# Altium schematic sheet BQ25XXX-EVALUATION.SchDoc
size A3; DocumentNumber: 5; SheetNumber: 5; SheetTotal: 14
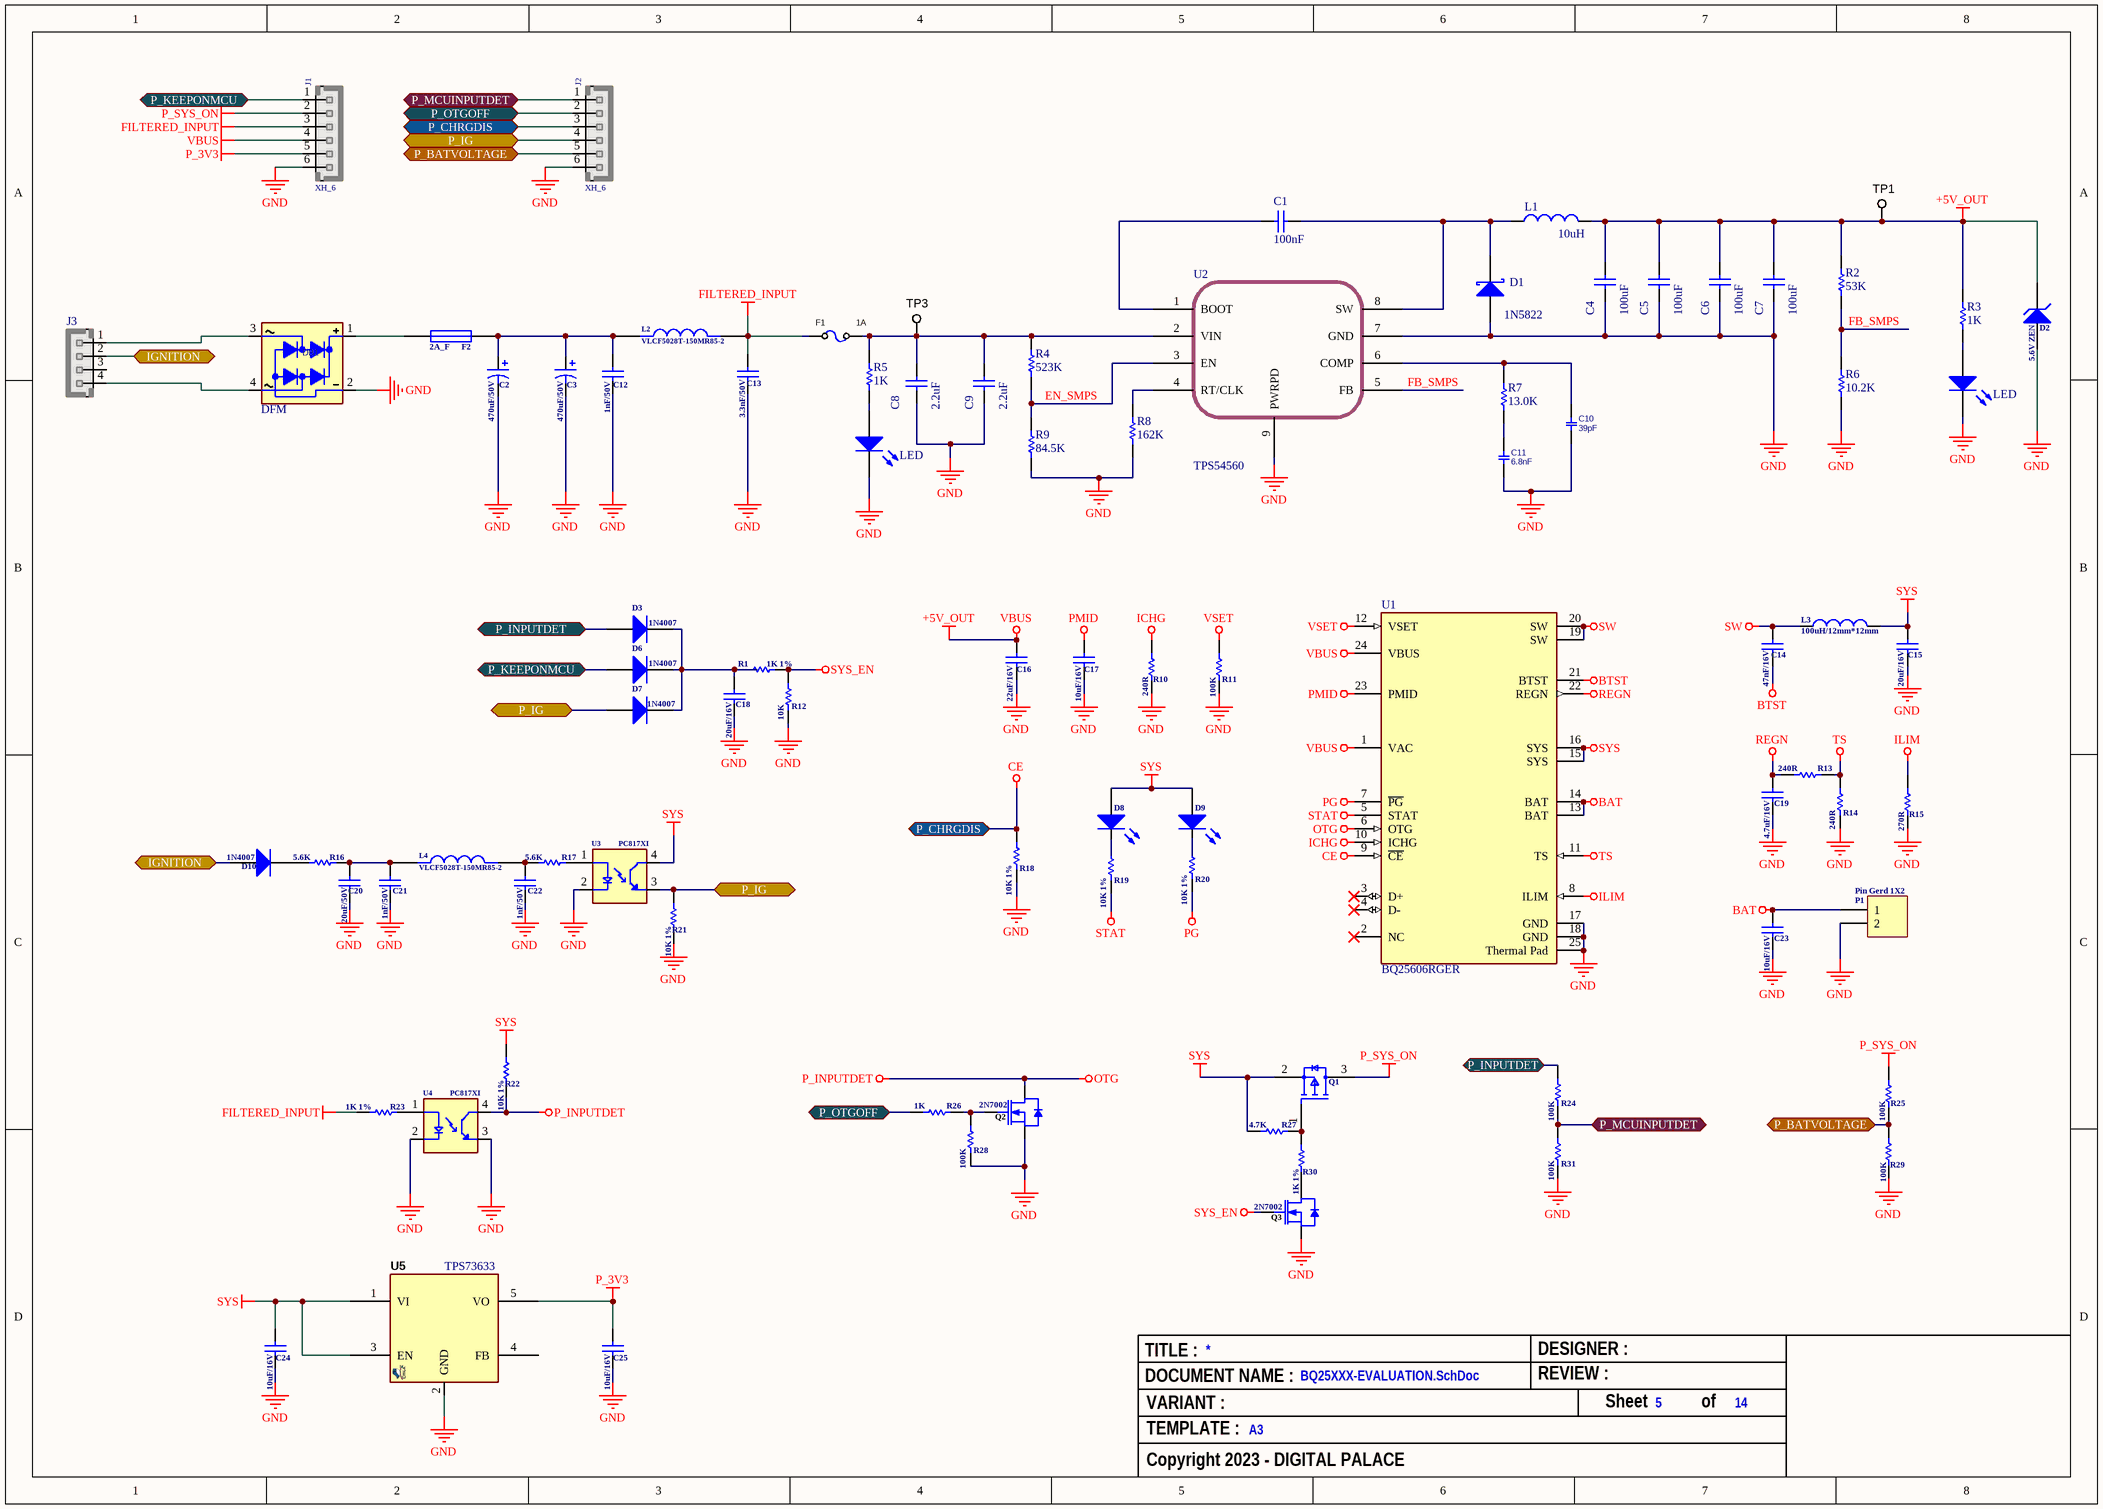
[diagram p0: BQ25XXX-EVALUATION.SchDoc]

## Parts
C1  100nF  [C0603E]
C2  value 470uF/50V  [CAPR5-10x10]
C3  value 470uF/50V  [CAPR5-10x10]
C4  100uF  [C1210]
C5  100uF  [C1210]
C6  100uF  [C1210]
C7  100uF  [C1210]
C8  2.2uF  [C1210]
C9  2.2uF  [C1210]
C10  39pF  [C0603E]
C11  6.8nF  [C0603E]
C12  value 1nF/50V  [C0805]
C13  value 3.3nF/50V  [C0805]
C14  value 47nF/16V  [C0805]
C15  value 20uF/16V  [C0805]
C16  value 22uF/16V  [C0805]
C17  value 10uF/16V  [C0805]
C18  value 20uF/16V  [C0805]
C19  value 4.7uF/16V  [C0805]
C20  value 20uF/50V  [C0805]
C21  value 1nF/50V  [C0805]
C22  value 1nF/50V  [C0805]
C23  value 10uF/16V  [C0805]
C24  value 10uF/16V  [C0805]
C25  value 10uF/16V  [C0805]
D1  1N5822  [D_SMC]
D2  value 5.6V ZEN  [Zener DO213]  (hidden comment: D Zener)
D3  value 1N4007  [Diode_SMC_2]  (hidden comment: SS34/5822)
D4  LED  [LED0603BLU]
D5  LED  [LED0603BLU]
D6  value 1N4007  [Diode_SMC_2]  (hidden comment: SS34/5822)
D7  value 1N4007  [Diode_SMC_2]  (hidden comment: SS34/5822)
D8  (no value)  [LED-0]
D9  (no value)  [LED-0]
D10  value 1N4007  [Diode_SMC_2]  (hidden comment: SS34/5822)
DB1  DFM  [DBRG_DIPSMD]
F1  1A  [F1206]
F2  value 2A_F  [FUSE_1206]  (hidden comment: 1A_FAST)
J1  XH_6  [XH_6]
J2  XH_6  [XH_6]
J3  HHDR_4  [XH_4]  (value not drawn)
L1  10uH  [L_10]
L2  VLCF5028T-150MR85-2  [IND_VLCF5028T-221MR22-2]
L3  value 100uH/12mm*12mm  [L_12X12]  (hidden comment: Inductor)
L4  VLCF5028T-150MR85-2  [IND_VLCF5028T-221MR22-2]
P1  value Pin Gerd 1X2  [HDR1X2]  (hidden comment: Header 2)
Q1  SI2305-TP  [FP-SOT-23-IPC_B]  (value not drawn)
Q2  value 2N7002  [SOT23]
Q3  value 2N7002  [SOT23]
R1  value 1K 1%  [J1-0603]
R2  53K  [R0603E]
R3  1K  [R0603E]
R4  523K  [R0603E]
R5  1K  [R0603E]
R6  10.2K  [R0603E]
R7  13.0K  [R0603E]
R8  162K  [R0603E]
R9  84.5K  [R0603E]
R10  value 240R  [6-0805_N]
R11  value 100K  [6-0805_N]
R12  value 10K  [J1-0603]
R13  value 240R  [6-0805_N]
R14  value 240R  [6-0805_N]
R15  value 270R  [6-0805_N]
R16  value 5.6K  [6-0805_N]
R17  value 5.6K  [6-0805_N]
R18  value 10K 1%  [6-0805_N]
R19  value 10K 1%  [6-0805_N]
R20  value 10K 1%  [6-0805_N]
R21  value 10K 1%  [6-0805_N]
R22  value 10K 1%  [6-0805_N]
R23  value 1K 1%  [6-0805_N]
R24  value 100K  [6-0805_N]
R25  value 100K  [J1-0603]
R26  value 1K  [6-0805_N]
R27  value 4.7K  [J1-0603]
R28  value 100K  [6-0805_N]
R29  value 100K  [J1-0603]
R30  value 1K 1%  [J1-0603]
R31  value 100K  [6-0805_N]
TP1  VALUE  [TPSMD_C120]  (value not drawn)  (no BOM)
TP3  VALUE  [TPSMD_C120]  (value not drawn)  (no BOM)
U1  BQ25606RGER  [FP-RGE0024H-MFG]
U2  TPS54560  [SO_8T]
U3  PC817XI  [SOIC254P975X460-4N]
U4  PC817XI  [SOIC254P975X460-4N]
U5  TPS73633  [SOT23_5]

## Ports
IGNITION (bidir), P_BATVOLTAGE (bidir), P_CHRGDIS (bidir), P_IG (bidir), P_INPUTDET (bidir), P_KEEPONMCU (bidir), P_MCUINPUTDET (bidir), P_OTGOFF (bidir)

## Nets
+5V_OUT: C4.2 C5.2 C6.2 C7.2 C16.1 D2.1(K) J1.4 L1.2 R2.1 R3.1 TP1.1 U1.1(VAC) U1.24(VBUS)  [also labelled VBUS]
BAT: C23.1 P1.1 U1.13(BAT) U1.14(BAT)
BTST: C14.2 U1.21(BTST)
CE: J2.3 R18.1 U1.9(~{CE}) ; port P_CHRGDIS
FILTERED_INPUT: C13.1 F1.2 J1.3 L2.2 R23.2
GND: C2.2 C3.2 C4.1 C5.1 C6.1 C7.1 C8.1 C9.1 C10.1 C11.1 C12.2 C13.2 C15.2 C16.2 C17.2 C18.2 C19.2 C20.2 C21.2 C22.2 C23.2 C24.2 C25.2 D1.1(A) D2.2(A) D4.2(K) D5.2(K) DB1.2(DCOUT-) J1.6 J2.6 P1.2 Q2.2(SOURCE) Q3.2(SOURCE) R6.2 R8.2 R9.2 R10.1 R11.1 R12.2 R14.1 R15.1 R18.2 R21.2 R28.2 R29.1 R31.2 U1.17(GND) U1.18(GND) U1.25(Thermal_Pad) U2.7(GND) U2.9(PWRPD) U3.2(C) U4.2(C) U4.3(ET) U5.2(GND)
ICHG: R10.2 U1.10(ICHG)
ILIM: R15.2 U1.8(ILIM)
OTG: Q2.3(DRAIN) R22.2 U1.6(OTG) U4.4(CT)  [also labelled P_INPUTDET]
P_3V3: C25.1 J1.5 U5.5(VO)
P_SYS_ON: J1.2 Q1.3(DRAIN) R25.1
PG: R20.2 U1.7(~{PG})
PMID: C17.1 U1.23(PMID)
REGN: C19.1 R13.2 U1.22(REGN)
STAT: R19.2 U1.5(STAT)
SW: C14.1 L3.1 U1.19(SW) U1.20(SW)
SYS: C15.1 C24.1 D8.1(A) D9.1(A) L3.2 Q1.2(SOURCE) R22.1 R27.2 U1.15(SYS) U1.16(SYS) U3.4(CT) U5.1(VI) U5.3(EN)
SYS_EN: Q3.1(GATE) R1.1 R12.1
TS: R13.1 R14.2 U1.11(TS)
VSET: R11.2 U1.12(VSET)
EN_SMPS: R4.2 R9.1 U2.3(EN)
FB_SMPS: R2.2 R6.1 U2.5(FB)
IGNITION: D10.2(A) J3.2 ; port IGNITION
P_BATVOLTAGE: J2.5 R25.2 R29.2 ; port P_BATVOLTAGE
P_IG: D7.2(A) J2.4 R21.1 U3.3(ET) ; port P_IG
P_INPUTDET: D3.2(A) R24.1 ; port P_INPUTDET
P_KEEPONMCU: D6.2(A) J1.1 ; port P_KEEPONMCU
P_MCUINPUTDET: J2.1 R24.2 R31.1 ; port P_MCUINPUTDET
P_OTGOFF: J2.2 R26.2 ; port P_OTGOFF
NetC1_1: C1.1 D1.2(K) L1.1 U2.8(SW)
NetC1_2: C1.2 U2.1(BOOT)
NetC2_1: C2.1 C3.1 C12.1 F2.2 L2.1
NetC8_2: C8.2 C9.2 F1.1 R4.1 R5.1 TP3.1 U2.2(VIN)
NetC10_2: C10.2 R7.1 U2.6(COMP)
NetC11_2: C11.2 R7.2
NetC18_1: C18.1 D3.1(K) D6.1(K) D7.1(K) R1.2
NetC20_1: C20.1 C21.1 L4.1 R16.1
NetC22_1: C22.1 L4.2 R17.2
NetD4_1: D4.1(A) R3.2
NetD5_1: D5.1(A) R5.2
NetD8_2: D8.2(K) R19.1
NetD9_2: D9.2(K) R20.1
NetDB1_1: DB1.1(DCOUT+) F2.1
NetDB1_3: DB1.3(ACIN2) J3.1
NetDB1_4: DB1.4(ACIN1) J3.4
NetQ1_1: Q1.1(GATE) R27.1 R30.2
NetQ2_1: Q2.1(GATE) R26.1 R28.1
NetQ3_3: Q3.3(DRAIN) R30.1
NetR8_1: R8.1 U2.4(RT/CLK)
NetR17_1: R17.1 U3.1(A)
NetR23_1: R23.1 U4.1(A)

Not connected (* = marked no-connect by the designer): D10 1(K); J3 3; R16 2; U1 2(NC)* 3(D+)* 4(D-)*; U5 4(FB)

## Notes on the sheet
- (near C16) Charger input voltage. Place a 1-uF ceramic capacitor from VBUS to GND and place it as close as possible to the IC.
- (near R10) A resistor is connected from ICHG pin to ground to set charge current limit as ICHG = KICHG/RICHG.
  The acceptable range for charge current is 300 mA to 3000 mA.
  TYPICAL KICHG = 677
- (near R11) VSET pin sets default battery charge voltage in the BQ25606. Program battery regulation voltage with a resistor pull-down from VSET to GND.
  RPD > 50 kΩ (float pin) = 4.208 V
  RPD < 500 Ω (short to GND) = 4.352 V
  5 kΩ < RPD < 25 kΩ = 4.400 V
- (near C14) Connect a 0.047-μF bootstrap capacitor from SW to BTST.
- (near C15) Connect the 20-µF capacitor close to the SYS pin.
- (near U1) Input voltage sensing. This pin must be shorted to the VBUS pin.
- (near R13) Connect a 4.7-μF (10-V rating) ceramic capacitor from REGN to analog GND. The capacitor should be placed close to the IC.
- (near R15) ILIM sets the input current limit.
  A resistor is connected from ILIM pin to ground to set the input current limit as IINDPM = KILIM/RILIM. The acceptable range for ILIM current is 500 mA to 3200 mA.
  This is to ensure the charger is not damanged if the system is using too much current.
  The excess current will be supplied from the battery if such a condition is met.
  Input current for us should be below 2A, that's the fused current in the current system.
  TYPICAL KLIM = 478
  IINDPM = 478/270
  IINDPM = 1.77A
- (near R18) Charge enable pin. When this pin is driven low, battery charging is enabled.
- (near R14) Program temperature window with a resistor divider from REGN to TS to GND.
  Charge suspends when TS pin voltage is out of range. Recommend 103AT-2 thermistor.
- (near R19) The STAT pin indicates charger status.
  Charge in progress: LOW
  Charge complete or charger in SLEEP mode: HIGH
  Charge suspend (fault response): Blink at 1 Hz
- (near R20) Open drain active low power good indicator.
- (near C23) Connect the 10-µF capacitor closely to the BAT pin.
- (near Q2) Boost mode enable pin. When this pin is pulled HIGH, OTG is enabled. OTG cannot be floating.
- TITLE :
- DOCUMENT NAME :
- DESIGNER :
- REVIEW :
- VARIANT :
- TEMPLATE :
- A3
- Sheet
- of
- Copyright 2023 - DIGITAL PALACE

## Library data of the parts
C1 C4-C9 = Cap: Capacitor; Published: 8-Jun-2000; LatestRevisionDate: 17-Jul-2002; LatestRevisionNote: Re-released for DXP Platform.; PackageReference: RAD-0.3; Publisher: Altium Limited
  C1: Value: 100nF
  C4-C7: Value: 100uF
  C8 C9: Value: 2.2uF
C2 C3 = Cap Pol1: Polarized Capacitor (Radial); Board_: Power; Published: 8-Jun-2000; LatestRevisionDate: 17-Jul-2002; LatestRevisionNote: Re-released for DXP Platform.; PackageReference: RB7.6-15; Publisher: Altium Limited; PackageDescription: Polarized Capacitor (Radial); 2 Leads
C10 C11 = CAP_SMD_MLCC_1206: CAP, MLCC, -F, -V, MATERIAL, -%, 0201; PARAM: -, -%; MANF_P#: MANF_PART#; PRICE: 100= 1$; MANF: -; PARAM2: -V; ASSEMBLY: ASSEMBLY
  C10: VALUE: 39pF
  C11: VALUE: 6.8nF
C12-C25 = Cap: Capacitor; Board_: Power; Published: 8-Jun-2000; LatestRevisionDate: 17-Jul-2002; LatestRevisionNote: Re-released for DXP Platform.; Publisher: Altium Limited
  C13: PackageReference: RAD-0.3; PackageDescription: Radial Cap, Thru-Hole; 2 Leads; 0.3 in Pin Spacing
D1 = D Schottky: Schottky Diode; Published: 8-Jun-2000; LatestRevisionDate: 17-Jul-2002; LatestRevisionNote: Re-released for DXP Platform.; PackageReference: SMB; Publisher: Altium Limited; Code_JEDEC: DO-214-AA; Value: 1N5822
D2 = D Zener: Zener Diode; Voltage: 5.6V; Board_: Power; Published: 8-Jun-2000; LatestRevisionDate: 17-Jul-2002; LatestRevisionNote: Re-released for DXP Platform.; PackageReference: DIODE-0.7; Publisher: Altium Limited; PackageDescription: Diode, Thru-Hole; 2 Leads; 0.7 in Pin Spacing
D3 D6 D7 D10 = Diode: Default Diode; Board_: Power; Published: 8-Jun-2000; LatestRevisionDate: 17-Jul-2002; LatestRevisionNote: Re-released for DXP Platform.; PackageVersion: Sep-1996; PackageReference: SMC; Publisher: Altium Limited; PackageDescription: DO-214-AB/SMC; 2 C-Bend Leads; Body 7.9 x 5.9 mm, inc. leads (LxW); Code_JEDEC: DO-214-AB
D4 D5 = LED3: Typical BLUE SiC LED; Published: 8-Jun-2000; LatestRevisionDate: 17-Dec-2003; LatestRevisionNote: PCB Footprint replaced.; DatasheetDocument: 16-Apr-2002; PackageDocument: 16-Apr-2002; PackageReference: 3.5X2.8X1.9; Publisher: Altium Limited; Value: LED
D8 D9 = LED0: LED SMD 0805; Value: LED SMD0805 RED; Board_: Power; Published: 8-Jun-2000; LatestRevisionDate: 08-Jul-2005; LatestRevisionNote: Mech Layer 1 removed.; PackageReference: LED-0; Publisher: Altium Limited; PackageDescription: LED; 2 Leads
DB1 = DIODE_THD_BRIDGE_RECT_DFM: DIODE, BRIDGE,; VALUE: DFM
F1 = FUSE_2A_1812: Fuse, 2A, -VDC, 1812, SMD, Fast Acting; MANF_P#: MANF_PART#; PARAM: 2A; MANF: MANF; PARAM2: PARAM2; VALUE: 1A
F2 = Fuse 1: Fuse; Board_: Power; Published: 8-Jun-2000; LatestRevisionDate: 17-Jul-2002; LatestRevisionNote: Re-released for DXP Platform.; PackageReference: PIN-W2/E2.8; Publisher: Altium Limited; PackageDescription: Thru-Hole; 2 Leads
J1 J2 = XH_6: JST-XH pitch: 2.5mm; MANF_P#: JST-S6B-XHA; MANF: JST; VALUE: XH_6
J3 = XH_4: JST-XH pitch: 2.5mm; VALUE: HHDR_4
L1 = Inductor: Code_IEC: 1005; Published: 8-Jun-2000; LatestRevisionDate: 17-Jul-2002; LatestRevisionNote: Re-released for DXP Platform.; PackageReference: 0402-A; Publisher: Altium Limited; Code_JEITA: 0402; Value: 10uH
L2 L4 = VLCF5028T-221MR22-2: SMD / SMT Inductor (Coil), 1.3 - 470 H, 100 kHz, 0.35 - 4.32 A, 19 - 2710 Ohm, 5 x 5 x 2.8 (LxWxH); MF: TDK; SnapEDA_Link: https://www.snapeda.com/parts/VLCF5028T-221MR22-2/TDK/view-part/?ref=snap; Package: NON STANDARD-2 TDK; Value: *; MP: VLCF5028T-221MR22-2; Check_prices: https://www.snapeda.com/parts/VLCF5028T-221MR22-2/TDK/view-part/?ref=eda
L3 = Inductor: Code_IEC: 1005; Board_: Power; Published: 8-Jun-2000; LatestRevisionDate: 29-May-2009; LatestRevisionNote: IPC-7351 Footprint Added.; PackageReference: 0402-A; Publisher: Altium Limited; PackageDescription: Chip Inductor; Code_JEITA: 0402
P1 = Header 2: Header, 2-Pin; Board_: Power; LatestRevisionDate: 17-Jul-2002; LatestRevisionNote: Re-released for DXP Platform.; Publisher: Altium Limited; Parameter 1: *
Q1 = CMP-56217-000001-1: P-CHANNEL MOSFET, SOT-23 PACKAGE; Max Power Dissipation: 350mW; Rds On Max: 90mR; Continuous Drain Current (ID): 4.1A; Drain to Source Voltage (Vdss): 8V; Packaging: Cut Tape; RoHS Compliant: Yes; Max Operating Temperature: 150°C; Mount: Surface Mount; Case/Package: SOT-23; Min Operating Temperature: -55°C
Q2 Q3 = 2N7002: NMOS; Manufacturer: Infineon; RDS (on) (max) (@4.5V): 4,000 mOhm; VDS (max): 60 V; IDpuls (max): 1.2Â A; Packing: Reel; QG: 0.4Â nC; RDS (on) (max): 3,000 mOhm; RthJA (max): 250 K/W; ID (max): 0.3Â A; VGS(th) (max): 2.5Â V; VGS(th) (min): 1.5Â V; Green: TRUE; Ptot (max): 0.5Â W; Board_: Power; PackageDescription: 3-Pin Small Outline Transistor Package, 2.9 x 1.3 mm Body, 0.95 mm Pitch; Halogen-free: TRUE; ComponentLink2Description: Datasheet; ComponentLink1URL: http://www.infineon.com/; DatasheetVersion: Rev. 2.4; PartNumber: 2N7002; PackageReference: PG-SOT23; PackageVersion: Apr-08; ComponentLink3URL: http://www.infineon.com/dgdl/SOT23-Package_Overview.pdf?folderId=db3a30431936bc4b0119532290053c66&fileId=db3a30431936bc4b0119533468123c85; ComponentLink1Description: Manufacturer URL; Mounting Technology: Surface Mount; ComponentLink3Description: Package Specification; ComponentLink2URL: http://www.infineon.com/dgdl/2N7002_Rev2.4.pdf?folderId=db3a3043156fd573011622e10b5c1f67&fileId=db3a304319bc939a0119c2a9461e79e6
R1 R10-R31 = Res1: Resistor; Board_: Power; Published: 8-Jun-2000; LatestRevisionDate: 17-Jul-2002; LatestRevisionNote: Re-released for DXP Platform.; PackageReference: AXIAL-0.3; Publisher: Altium Limited; PackageDescription: Axial Device, Thru-Hole; 2 Leads; 0.3 in Pin Spacing
R2-R9 = Res1: Resistor; Published: 8-Jun-2000; LatestRevisionDate: 17-Jul-2002; LatestRevisionNote: Re-released for DXP Platform.; PackageReference: AXIAL-0.3; Publisher: Altium Limited
  R2: Value: 53K
  R3 R5: Value: 1K
  R4: Value: 523K
  R6: Value: 10.2K
  R7: Value: 13.0K
  R8: Value: 162K
  R9: Value: 84.5K
TP1 TP3 = TESTPOINT_SMD: TEST POINT; MANF: MANF; MANF_P#: MANF_P#; VALUE: VALUE
U1 = BQ25606: IC BATT CHG LI-ION 1 CELL 24VQFN; Battery Pack Voltage: 4.4V; Interface: USB; Number of Cells: 1; Max Charge Current: 3A; Fault Protection: Over Voltage; Max Supply Voltage: 13.5V; Max Operating Temperature: 85°C; Mount: Surface Mount; Min Operating Temperature: -40°C; Packaging: Tape and Reel; Case/Package: VQFN
U2 = TPS54360DDA: TEXAS INSTRUMENTS - TPS54360DDA - DC/DC-Abwärts-Schaltregler (Buck), einstellbar, 4.5V-60Vin, 800mV-58.8Vout, 3.5Aout, SOIC-8; Output Current: 3.5A; Switching Frequency: 2.5MHz; Output Voltage: 58.8V; Number of Outputs: 1; Min Input Voltage: 4.5V; Max Input Voltage: 60V; Synchronous Rectifier: Yes; Output Type: Adjustable; Min Output Voltage: 800mV; Quiescent Current: 146uA; Supplier 1: Digi-Key; Manufacturer: Texas Instruments; Manufacturer Part Number: TPS54360DDA; RoHS: Yes; Category: Voltage Regulators - Switching; Pricing 1: 1=6.66000, 10=5.98400, 25=5.65720, 100=4.90290, 250=4.65148, 500=4.17378, 1000=4.15100 (USD); Mount: Surface Mount; Case/Package: HSOP; Number of Pins: 8; Contact Plating: Gold; Weight: 0.00249oz; Min Operating Temperature: -40°C; Max Operating Temperature: 125°C; Package Quantity: 75; Packaging: Rail/Tube; Operating Supply Voltage: 60V; Max Output Current: 3.5A; Max Output Voltage: 58.8V; Min Supply Voltage: 4.5V; Series: Eco-Mode™; Radiation Hardening: No; Lead Free: Lead Free; RoHS Compliant: Yes; REACH SVHC: No SVHC; ComponentLink1URL: https://datasheet.ciiva.com/14303/tps54360-14303681.pdf?src-supplier=Avnet; ComponentLink1Description: https://datasheet.ciiva.com/14303/tps54360-14303681.pdf?src-supplier=Avnet; ComponentLink2URL: https://datasheet.ciiva.com/28375/tps54360-28375911.pdf?src-supplier=Avnet+Europe; ComponentLink2Description: https://datasheet.ciiva.com/28375/tps54360-28375911.pdf?src-supplier=Avnet+Europe; ComponentLink3URL: https://datasheet.ciiva.com/46419/1857519-46419180.pdf?src-supplier=Element14; ComponentLink3Description: https://datasheet.ciiva.com/46419/1857519-46419180.pdf?src-supplier=Element14; Value: TPS54560; Supplier Part Number 1: 296-35014-ND
U3 U4 = PC817XI: Optoisolator Transistor Output 5000Vrms 1 Channel 4-SMD; MF: Sharp Microelectronics; Price: None; Availability: In Stock; Package: SMD-4 Sharp Microelectronics; MP: PC817XI; Value: *; SnapEDA_Link: https://www.snapeda.com/parts/PC817XI/Sharp+Microelectronics/view-part/?ref=snap; Purchase-URL: https://pricing.snapeda.com/search/part/PC817XI/?ref=eda; Check_prices: https://www.snapeda.com/parts/PC817XI/Sharp+Microelectronics/view-part/?ref=eda
U5 = VREG_TPS73633_SOT23: REG, Linear, LDO0.075V, 0.4A, 3.3V, SOT23-5 SMD; PARAM2: VIN 3.5V to 5.5V, VOUT 3.3V; MANF: Texas Instruments; MANF_P#: TPS73633DBVT; PARAM: LDO0.075V, 0.4A; VALUE: TPS73633